# EAGLE design Adafruit MCP9601 (EAGLE 9.6.2)
COMPANY: Adafruit Industries; DRAWN: KTOWN; REV: A; YEAR: 2019
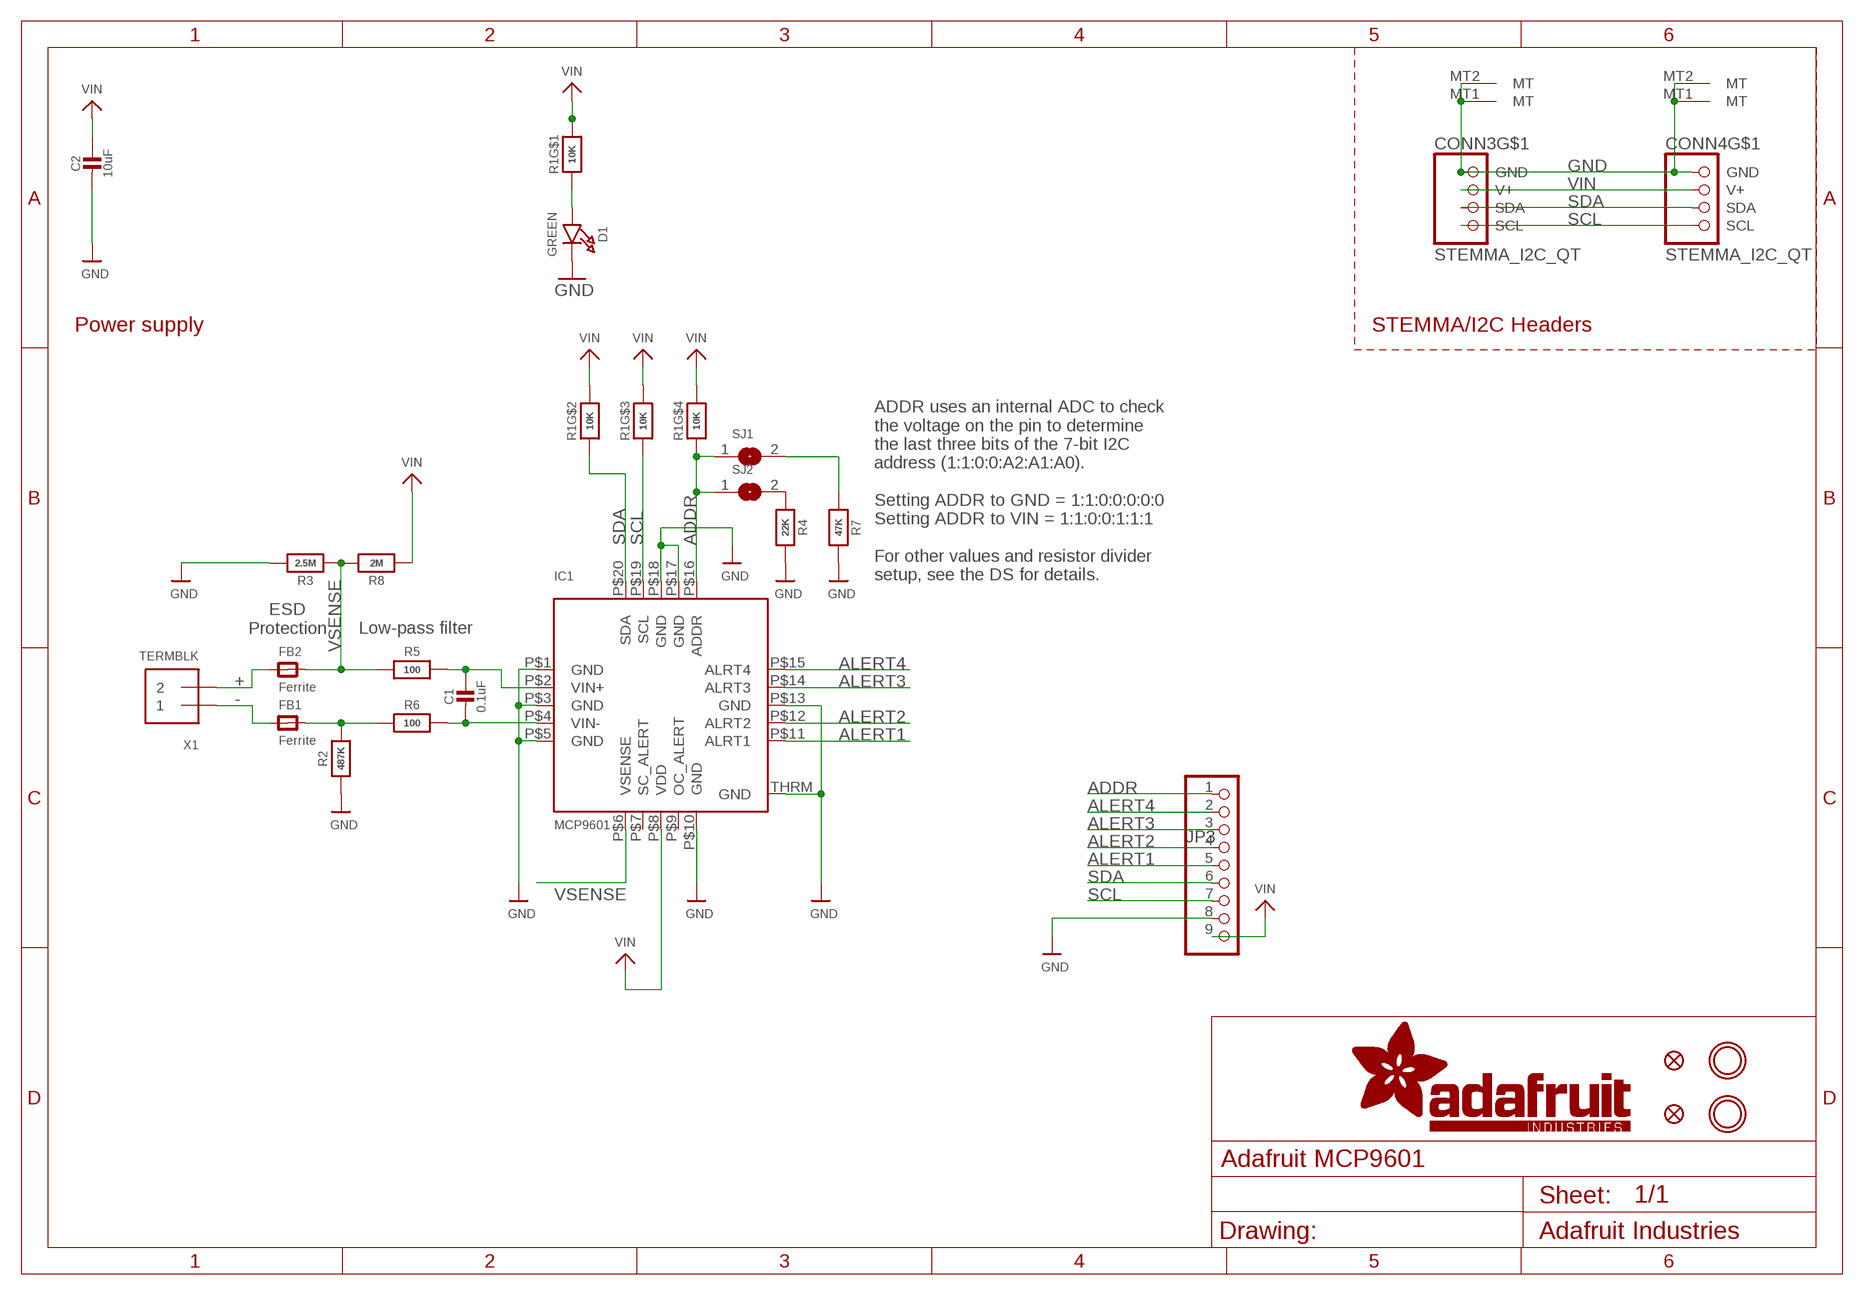
[diagram p0: schematic, sheet 1]

## Parts
C1  0.1uF  CAP_CERAMIC0603_NO  [0603-NO]
C2  10uF  CAP_CERAMIC0805-NOOUTLINE  [0805-NO]
CONN3  STEMMA_I2C_QT  [JST_SH4]
CONN4  STEMMA_I2C_QT  [JST_SH4]
D1  GREEN  LED0603_NOOUTLINE  [CHIPLED_0603_NOOUTLINE]
FB1  Ferrite  FERRITE-0603NO  [0603-NO]
FB2  Ferrite  FERRITE-0603NO  [0603-NO]
FID3  FIDUCIAL_1MM  [FIDUCIAL_1MM]
FID4  FIDUCIAL_1MM  [FIDUCIAL_1MM]
IC1  MCP9601  [VQFN20_5MM]
JP3  HEADER-1X970MIL  [1X09_ROUND_70]
R1  10K  RESISTOR_4PACK  [RESPACK_4X0603]
R2  487K  RESISTOR_0603_NOOUT  [0603-NO]
R3  2.5M  RESISTOR_0603_NOOUT  [0603-NO]
R4  22K  RESISTOR_0603_NOOUT  [0603-NO]
R5  100  RESISTOR_0603_NOOUT  [0603-NO]
R6  100  RESISTOR_0603_NOOUT  [0603-NO]
R7  47K  RESISTOR_0603_NOOUT  [0603-NO]
R8  2M  RESISTOR_0603_NOOUT  [0603-NO]
SJ1  SOLDERJUMPER  [SOLDERJUMPER_ARROW_NOPASTE]
SJ2  SOLDERJUMPER  [SOLDERJUMPER_ARROW_NOPASTE]
U$33  MOUNTINGHOLE2.5  [MOUNTINGHOLE_2.5_PLATED]
U$34  MOUNTINGHOLE2.5  [MOUNTINGHOLE_2.5_PLATED]
X1  TERMBLK  TERMBLOCK_1X2_3.5MM  [TERMBLOCK_1X2-3.5MM]

## Nets
+: FB2.1 X1.2
-: FB1.1 X1.1
ADDR: IC1.P$16(ADDR) JP3.1 R1.4 SJ1.1 SJ2.1
ALERT1: IC1.P$11(ALRT1) JP3.5
ALERT2: IC1.P$12(ALRT2) JP3.4
ALERT3: IC1.P$14(ALRT3) JP3.3
ALERT4: IC1.P$15(ALRT4) JP3.2
GND: C2.2 CONN3.1(GND) CONN3.MT1(MT) CONN3.MT2(MT) CONN4.1(GND) CONN4.MT1(MT) CONN4.MT2(MT) D1.C IC1.P$1(GND) IC1.P$3(GND) IC1.P$5(GND) IC1.P$10(GND) IC1.P$13(GND) IC1.P$17(GND) IC1.P$18(GND) IC1.THRM(GND) JP3.8 R2.1 R3.2 R4.2 R7.2
N$1: C1.1 IC1.P$2(VIN+) R5.2
N$2: D1.A R1.1
N$3: C1.2 IC1.P$4(VIN-) R6.2
N$4: FB1.2 R2.2 R6.1
N$7: R7.1 SJ1.2
N$8: R4.1 SJ2.2
SCL: CONN3.4(SCL) CONN4.4(SCL) IC1.P$19(SCL) JP3.7 R1.3
SDA: CONN3.3(SDA) CONN4.3(SDA) IC1.P$20(SDA) JP3.6 R1.2
VIN: C2.1 CONN3.2(V+) CONN4.2(V+) IC1.P$8(VDD) JP3.9 R1.5 R1.6 R1.7 R1.8 R8.1
VSENSE: FB2.2 IC1.P$6(VSENSE) R3.1 R5.1 R8.2
Unconnected: IC1.P$7(SC_ALERT) IC1.P$9(OC_ALERT)

## Notes on the sheet
- Power supply | STEMMA/I2C Headers
- ADDR uses an internal ADC to check
  the voltage on the pin to determine
  the last three bits of the 7-bit I2C
  address (1:1:0:0:A2:A1:A0).
  
  Setting ADDR to GND = 1:1:0:0:0:0:0
  Setting ADDR to VIN = 1:1:0:0:1:1:1
  
  For other values and resistor divider
  setup, see the DS for details.
- ESD
  Protection
- Low-pass filter

## Library data of the parts
C1 C2 = microbuilder:CAP_CERAMIC: Ceramic Capacitors For new designs, use the packages preceded by an '_' character since they are more reliable: The following footprints should be used on most boards: _0402 - Standard footprint for regular board layouts _0603 - Standard footprint for regular board layouts _0805 - Standard footprint for regular board layouts _1206 - Standard footprint for regular board layouts For extremely tight-pitch boards where space is at a premium, the following 'micro-pitch' footprints can be used (smaller pads, no silkscreen outline, etc.): _0402MP - Micro-pitch footprint for very dense/compact boards _0603MP - Micro-pitch footprint for very dense/compact boards _0805MP - Micro-pitch footprint for very dense/compact boards _1206MP - Micro-pitch footprint for very dense/compact boards
CONN3 CONN4 = microbuilder:STEMMA_I2C
D1 = microbuilder:LED: LED 0603 - 0603 Surface Mount Package 2mA: Green LED - Low Power (3.9mcd, 2ma, 1.7Vf) - Digikey: 475-2709-2-ND Orange LED - Low Power (9.8mcd, 2ma, 1.8Vf) - Digikey: 475-1194-2-ND Red LED - Low Power (5mcd, 2ma, 1.8Vf) - Digikey: 475-1195-2-ND Yellow LED - Low Power (7mcd, 2ma, 1.8Vf) - Digikey: 475-1196-2-ND 5mA: Blue LED - Low Power (17mcd, 5ma, 2.9Vf) - Digikey: LNJ937W8CRACT-ND 0805 - 0805 Surface Mount Package 2mA: Red LED (8.8mcd, 2mA, 1.8Vf, Clear) - Low Power [Digikey: 475-2510-1-ND] Green LED (5mcd, 2mA, 1.8Vf, Clear) - Low Power [Digikey: 475-2730-1-ND] Yellow LED (11.3mcd, 2mA, 1.8Vf, Clear) - Low Power [Digikey: 475-2555-1-ND] 20mA: Red LED (104mcd, 20mA, Diffused) - LS R976 [Digikey: 475-1278-6-ND] Red LED (12mcd, 20mA, 2.0Vf, Clear) - APT2012EC [Digikey: 754-1128-1-ND] Green LED (15mcd, 20mA, 2.2Vf, Clear) - APT2012GC [Digikey: 754-1131-1-ND] Orange LED (160mcd, 20mA, 2.1Vf, Clear) - APT2012SECK [Digikey: 754-1130-1-ND] 1206 - 1206 Surface Mount Package Green LED (26mcd, 20mA, Diffused) - LG N971 [Digikey: 475-1407-6-ND] Red LED (15mcd, 20mA, Diffused) - LH N974 [Digikey: 475-1416-6-ND] Cree - Cree High-Power Surface Mount LEDs XPEBWT-L1-0000-00D50 - White 111lm 350mA 2.9Vf 6200K 110° XTEAWT-00-0000-00000LEE3 - White 114lm 350mA 2.85Vf 5000K 115° Everlight - Everlight 45-21 Series Surface Mount LEDs 45-21/QK2C-B2832AC2CB2/2T - Warm White 2000mcd 20mA 3.25Vf 3050K 120° 45-21/LK2C-B38452C4CB2/2T - Nuetral White 2000mcd 20mA 3.25Vf 4150K 120° 45-21/LK2C-B50634C6CB2/2T - Cold White 2200mcd 20mA 3.25Vf 5650K 120° PLCC2 Reverse Mount LS T77K-J1L2-1-0-2-R18-Z - Red 11.25mcd 2mA 1.8Vf 630nm 120° LO T77K-L1M2-24-Z - Orange 19.6mcd 2mA 1.8Vf 606nm 120° LY T77K-K2M1-26-Z - Yellow 15.7mcd 2mA 1.8Vf 587nm 120°
FB1 FB2 = microbuilder:FERRITE: Ferrite Bead 0603 MMZ1608B121C - 120 Ohm @ 100MHz, 600mA, 0.15 Ohm DC Resistance - Digikey: 445-2164-1-ND BK1608HW121-T - 120 Ohm, 600mA Ferrite Chip - Digikey: 587-1876-2-ND 0805 HZ0805B272R-10 - 2.7K Ohm @ 100MHz, 200mA, 0.8 Ohm DC Resistance - Digikey: 240-2504-1-ND (see also Murata BLM21BD272SN1L) MMZ2012Y152B - 1.5K Ohm @ 100MHz, 500mA, 0.4 Ohm DC Resistance - Digikey: 445-1560-1-ND - Mainly for high frequency (80-400MHz) MMZ2012R102A - 1K Ohm @ 100MHz, 500mA, 0.3 Ohm DC Resistance - Digikey: 445-1555-2-ND - More general purpose (10-200MHz)
FID3 FID4 = microbuilder:FIDUCIAL: Fiducial Alignment Points Various fiducial points for machine vision alignment.; BOM: EXCLUDE
IC1 = adafruit_sensor:MCP9601
JP3 = microbuilder:HEADER-1X9: PIN HEADER
R1 = microbuilder:RESISTOR_4PACK: Resistor Packs (4 resistors) 4 x 0603 10K 1/16W - Digikey: YC164J-10KCT-ND
R2-R8 = microbuilder:RESISTOR: Resistors For new designs, use the packages preceded by an '_' character since they are more reliable: The following footprints should be used on most boards: _0402 - Standard footprint for regular board layouts _0603 - Standard footprint for regular board layouts _0805 - Standard footprint for regular board layouts _1206 - Standard footprint for regular board layouts For extremely tight-pitch boards where space is at a premium, the following 'micro-pitch' footprints can be used (smaller pads, no silkscreen outline, etc.): _0402MP - Micro-pitch footprint for very dense/compact boards _0603MP - Micro-pitch footprint for very dense/compact boards _0805MP - Micro-pitch footprint for very dense/compact boards _1206MP - Micro-pitch footprint for very dense/compact boards
SJ1 SJ2 = microbuilder:SOLDERJUMPER: SMD Solder JUMPER Solder the two pads together to create a connection, or remove the solder to break it. REFLOW - Use this footprint for solder paste and reflow ovens. WAVE - Use this footprint for hand-soldering (larger pads). CLOSED - Has a trace between the two pads to ensure it is closed by default. The trace needs to be cut to disable the jumper, and can be closed again by creating a solder bridge between the two pads.; BOM: EXCLUDE
U$33 U$34 = microbuilder:MOUNTINGHOLE: Mounting Hole For #2 screws (0.086"/2.18mm width, 0.094"/2.4mm hole) use 2.5mm; BOM: EXCLUDE
X1 = microbuilder:TERMBLOCK_1X2: 3.5mm Terminal block http://www.ladyada.net/library/pcb/eaglelibrary.html

## Net classes
1 highpower: width 0.305 mm, drill 0.483 mm
2 lowpower: width 0.254 mm, drill 0.483 mm

## Board
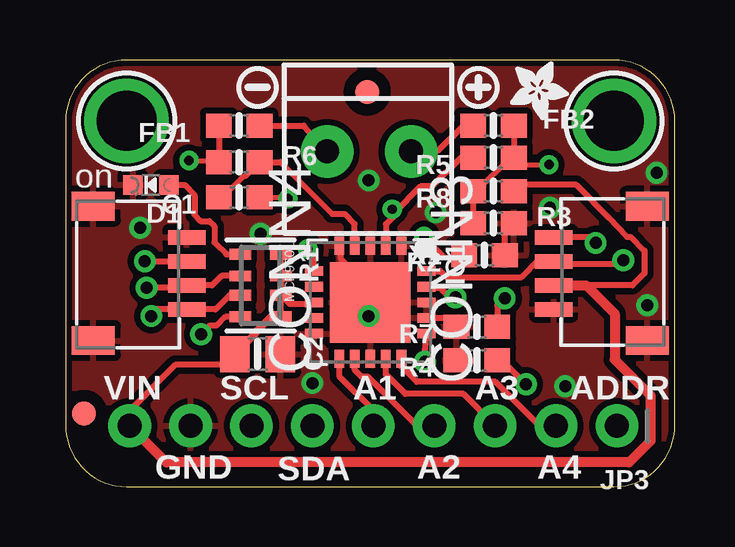
[diagram p1: board, top side]
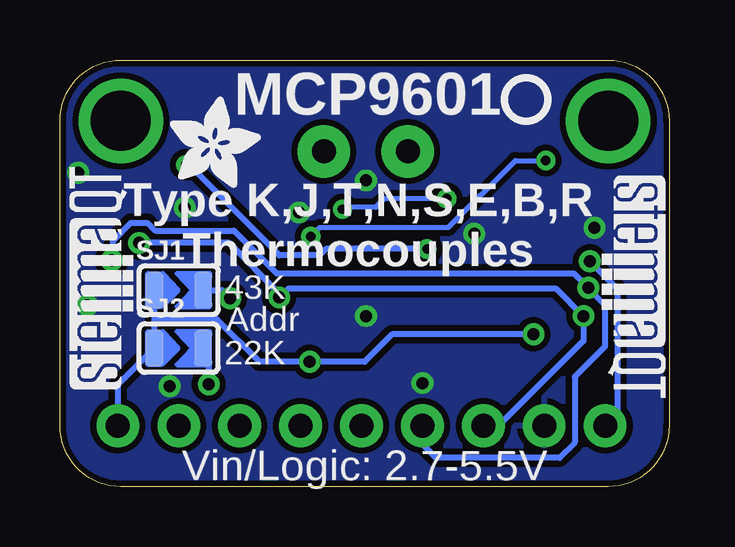
[diagram p2: board, bottom side, seen from below]

Size 25.4 x 17.78 mm. Coordinates in mm from the lower left corner, seen from the top.
Outline: 0,15.24 0,2.54 arc90 2.54,0 22.86,0 arc90 25.4,2.54 25.4,15.24 arc90 22.86,17.78 2.54,17.78 arc90 0,15.24
Copper layers (1*16): Top 0.035mm / dielectric 1.5mm / Bottom 0.035mm
Design rules "adafruit *": minimum track width 8mil, minimum drill 15.5mil, track to track 10mil, track to pad 10mil, pad to pad 8mil, via to via 8mil, smd to smd 8mil, copper to edge 10mil, drill to drill 8mil, minimum pad ring 10mil, minimum via ring 8mil, stop-mask expansion 2mil, vias tented up to drill 20mil, thermal gap 10mil

### Footprints (pad centres in the part's own frame; a part is rotated, then mirrored left to right if it is on the bottom)
0603-NO = smd 1.075 x 1: 1 -0.85,0; 2 0.85,0
0805-NO = smd 1.24 x 1.5: 1 -0.95,0; 2 0.95,0
JST_SH4 = smd 0.6 x 1.55: 1 -1.5,2.514; 2 -0.5,2.514; 3 0.5,2.514; 4 1.5,2.514 | smd 1.2 x 1.8: MT1 -2.8,-1.386; MT2 2.8,-1.386
CHIPLED_0603_NOOUTLINE = smd 0.8 x 0.8: A 0,-0.75; C 0,0.75
FIDUCIAL_1MM = smd 1 x 1: 1 0,0
VQFN20_5MM = smd 0.75 x 0.4: P$1 -2.35,1.3; P$2 -2.35,0.65; P$3 -2.35,0; P$4 -2.35,-0.65; P$5 -2.35,-1.3; P$11 2.35,-1.3; P$12 2.35,-0.65; P$13 2.35,0; P$14 2.35,0.65; P$15 2.35,1.3 | smd 0.4 x 0.75: P$6 -1.3,-2.35; P$7 -0.65,-2.35; P$8 0,-2.35; P$9 0.65,-2.35; P$10 1.3,-2.35; P$16 1.3,2.35; P$17 0.65,2.35; P$18 0,2.35; P$19 -0.65,2.35; P$20 -1.3,2.35 | smd 3.35 x 3.35: THRM 0,0
1X09_ROUND_70 = drill 1 pad 1.778: 1 -10.16,0; 2 -7.62,0; 3 -5.08,0; 4 -2.54,0; 5 0,0; 6 2.54,0; 7 5.08,0; 8 7.62,0; 9 10.16,0
RESPACK_4X0603 = smd 0.45 x 0.9: 1 -1.3,-0.85; 2 -0.4,-0.85; 3 0.4,-0.85; 4 1.3,-0.85; 5 1.3,0.85; 6 0.4,0.85; 7 -0.4,0.85; 8 -1.3,0.85
SOLDERJUMPER_ARROW_NOPASTE = smd 0.762 x 1.524: 1 -1.016,0; 2 1.016,0
MOUNTINGHOLE_2.5_PLATED = drill 2.5 pad 3.2: P$1 0,0
TERMBLOCK_1X2-3.5MM = drill 1 pad 2.184: 1 1.8,0; 2 -1.7,0

### Placement (x,y rotation side)
C1  7.24,12.06 180 top
C2  8,5.52 0 top
CONN3  22.86,8.89 90 top
CONN4  2.54,8.89 270 top
D1  3.56,12.57 90 top
FB1  7.24,15.05 180 top
FB2  17.84,15.05 0 top
FID3  0.76,3.05 0 top
FID4  12.57,16.45 0 top
IC1  12.7,7.68 270 top
JP3  12.83,2.54 180 top
R1  8.13,8.38 270 top
R2  17.46,9.65 180 top
R3  17.84,10.99 0 top
R4  17.14,5.27 180 top
R5  17.84,13.72 180 top
R6  7.24,13.53 0 top
R7  17.14,6.67 180 top
R8  17.84,12.32 180 top
SJ1  20.45,8.19 0 bottom
SJ2  20.45,5.78 0 bottom
U$16  [ADAFRUIT_2.5MM]  18.54,17.72 270 top
U$17  [SYMBOL_PLUS]  17.21,16.64 0 top
U$18  [SYMBOL_MINUS]  8,16.64 0 top
U$20  [ADAFRUIT_3.5MM]  20.83,12.45 0 bottom
U$33  2.54,15.24 0 top
U$34  22.86,15.24 0 top
U$40  [PCBFEAT-REV-040]  5.97,16.13 0 bottom
U$41  [STEMMAQT]  22.35,4.06 90 bottom
U$42  [STEMMAQT]  2.79,12.95 270 bottom
X1  12.7,13.97 180 top

### Tracks (layer width: path | path; a pad name or v marks a point on that pad's centre or on a via)
+
  Top 0.254: FB2.1 16.58,15.05 15.53,14 X1.2
-
  Top 0.254: FB1.1 9.93,15.05 X1.1
ADDR  (via drill 0.5)
  Top 0.254: R1.4 6.66,7.08 6.28,6.71 6.01,6.71 v5.65,6.35 | v14.99,5.21 14.92,5.27 IC1.P$16
  Bottom 0.254: v5.65,6.35 11.56,6.35 12.7,5.21 v14.99,5.21 17.08,5.21 18.86,6.99 21.46,6.99 | SJ1.1 21.46,6.99 | 21.46,6.99 SJ2.1 22.99,4.25 JP3.1
ALERT1
  Top 0.254: JP3.5 12.83,3.18 11.4,4.61 IC1.P$11
ALERT2
  Top 0.254: JP3.4 14.65,2.54 12.62,4.58 12.34,4.58 12.05,4.87 IC1.P$12
ALERT3
  Top 0.254: JP3.3 16.58,3.87 14.16,3.87 13.35,4.68 IC1.P$14
ALERT4
  Top 0.254: JP3.2 19.75,2.54 17.92,4.37 14.64,4.37 14,5.01 IC1.P$15
GND  (via drill 0.5)
  Top 0.254: IC1.P$17 15.93,7.03 R7.2 | IC1.P$5 11.47,9.96 11.47,9.5 12.7,8.27 IC1.THRM | R2.1 18.31,10.6 R3.2
  other vias: 12.64,7.11 3.11,10.79 12.64,12.76 24.64,13.08 24.26,7.56 20.83,4.19 10.29,4.32 15.43,11.43 8.13,10.54 20.19,11.62
  pour Top: 0,17.78 25.4,17.78 25.4,0 0,0
  pour Bottom: 0,17.78 25.4,17.78 25.4,0 0,0
N$1  (via drill 0.39)
  Top 0.203: C1.1 9.21,12.06 v9.27,12 | v13.62,11.56 13.68,11.56 13.68,11.4 13.68,11.27
  Top 0.254: R5.2 16.48,13.72 15.28,12.51 14.8,12.51 13.68,11.4 | 13.68,11.27 13.35,10.94 IC1.P$2
  Bottom 0.203: v9.27,12 11.87,12 12.24,11.64 13.54,11.64 v13.62,11.56
N$2
  Top 0.254: D1.A 4.95,12.57 5.37,12.15 5.37,11.33 5.63,11.07 5.99,11.07 6.21,10.85 6.21,10.17 6.7,9.68 R1.1
N$3
  Top 0.203: R6.2 7.48,12.92 7.4,12.92 6.55,12.06 C1.2 | 8.95,13.53 11.11,11.37
  Top 0.254: R6.2 8.95,13.53 | IC1.P$4 12.05,10.94 11.62,11.37 11.11,11.37
N$4  (via drill 0.39)
  Top 0.203: v14.94,10.42 15.81,9.56 16.52,9.56 R2.2 | v5.14,13.59 6.33,13.59 R6.1
  Top 0.254: FB1.2 R6.1
  Bottom 0.203: v14.94,10.42 14.56,10.8 9.2,10.8 6.41,13.59 v5.14,13.59
N$7  (via drill 0.5)
  Top 0.254: v18.31,7.86 18,7.54 R7.1
  Bottom 0.254: SJ1.2 18.64,8.19 v18.31,7.86
N$8  (via drill 0.5)
  Top 0.254: v19.2,4.27 18.2,5.27 R4.1
  Bottom 0.254: SJ2.2 19.2,5.54 v19.2,4.27
SCL  (via drill 0.5)
  Top 0.254: v22.1,10.16 21.87,10.39 CONN3.4 | R1.3 6.84,7.98 6.25,7.39 CONN4.4 3.78,7.39 3.57,7.18 v3.57,7.11 | IC1.P$19 15.11,8.27 15.62,8.27 16,7.89 v16.26,7.89
  Bottom 0.254: v22.1,10.16 18.35,10.16 16.26,8.06 v16.26,7.89 15.88,8.27 4.73,8.27 v3.57,7.11 3.57,6.08 7.11,2.54 JP3.7
SDA  (via drill 0.5)
  Top 0.254: IC1.P$20 15.62,8.98 15.88,8.73 19.02,8.73 19.68,9.39 CONN3.3 20.47,9.26 23.08,9.26 v23.25,9.43 | R1.2 6.5,8.78 6.1,8.39 CONN4.3 4.95,8.29 v3.37,8.29
  Bottom 0.254: JP3.6 10.29,1.78 9.72,1.21 4.57,1.21 3.94,1.84 3.94,4.57 2.67,5.83 2.67,7.59 v3.37,8.29 3.97,8.89 16.36,8.89 18.14,10.67 21.43,10.67 21.75,10.99 22.44,10.99 23.19,10.25 23.19,9.43 v23.25,9.43
VIN  (via drill 0.5)
  Top 0.254: 9.05,7.91 9.34,7.62 10.16,7.62 IC1.P$8 | 9.05,7.91 R1.6 R1.7 R1.8 | R1.5 8.98,7.11 8.98,7.83 9.05,7.91 | v3.3,9.4 CONN4.2 | C2.1 6.61,5.08 4.57,5.08 2.67,3.17 JP3.9 | 21.4,8.39 23.63,8.39 24.13,8.89 24.13,9.84 23.56,10.41 23.4,10.41 22.65,11.21 21.29,12.57 18.95,12.57 R8.1
  Top 0.305: C2.1 7.92,6.4 7.92,6.44 8.59,7.11 8.98,7.11
  Top 0.406: CONN3.2 21.4,8.39 21.71,8.39 22.89,7.21 22.89,5.3 24.38,3.81 24.38,1.91 23.5,1.02 4.19,1.02 JP3.9
  Bottom 0.254: JP3.9 2.16,3.05 2.16,8.26 v3.3,9.4
VSENSE  (via drill 0.39)
  Top 0.203: R5.1 18.99,13.42 v20.15,13.42 | 18.53,13.72 17.14,12.32 R8.2
  Top 0.254: FB2.2 R5.1 18.53,13.72 | IC1.P$6 10.35,9.65 v10.1,9.91 | R3.1 R8.2
  Bottom 0.254: v10.1,9.91 14.31,9.91 14.58,9.64 16.25,9.64 20.02,13.42 v20.15,13.42

### Text on the board
tPlace: on | VIN | SCL | A1 | A3 | ADDR | GND | SDA | A2 | A4
bPlace: MCP9601 | Type K,J,T,N,S,E,B,R / Thermocouples | 43K | Addr | 22K | Vin/Logic: 2.7-5.5V